# EAGLE design USBasp_smd03 (EAGLE 4.16)
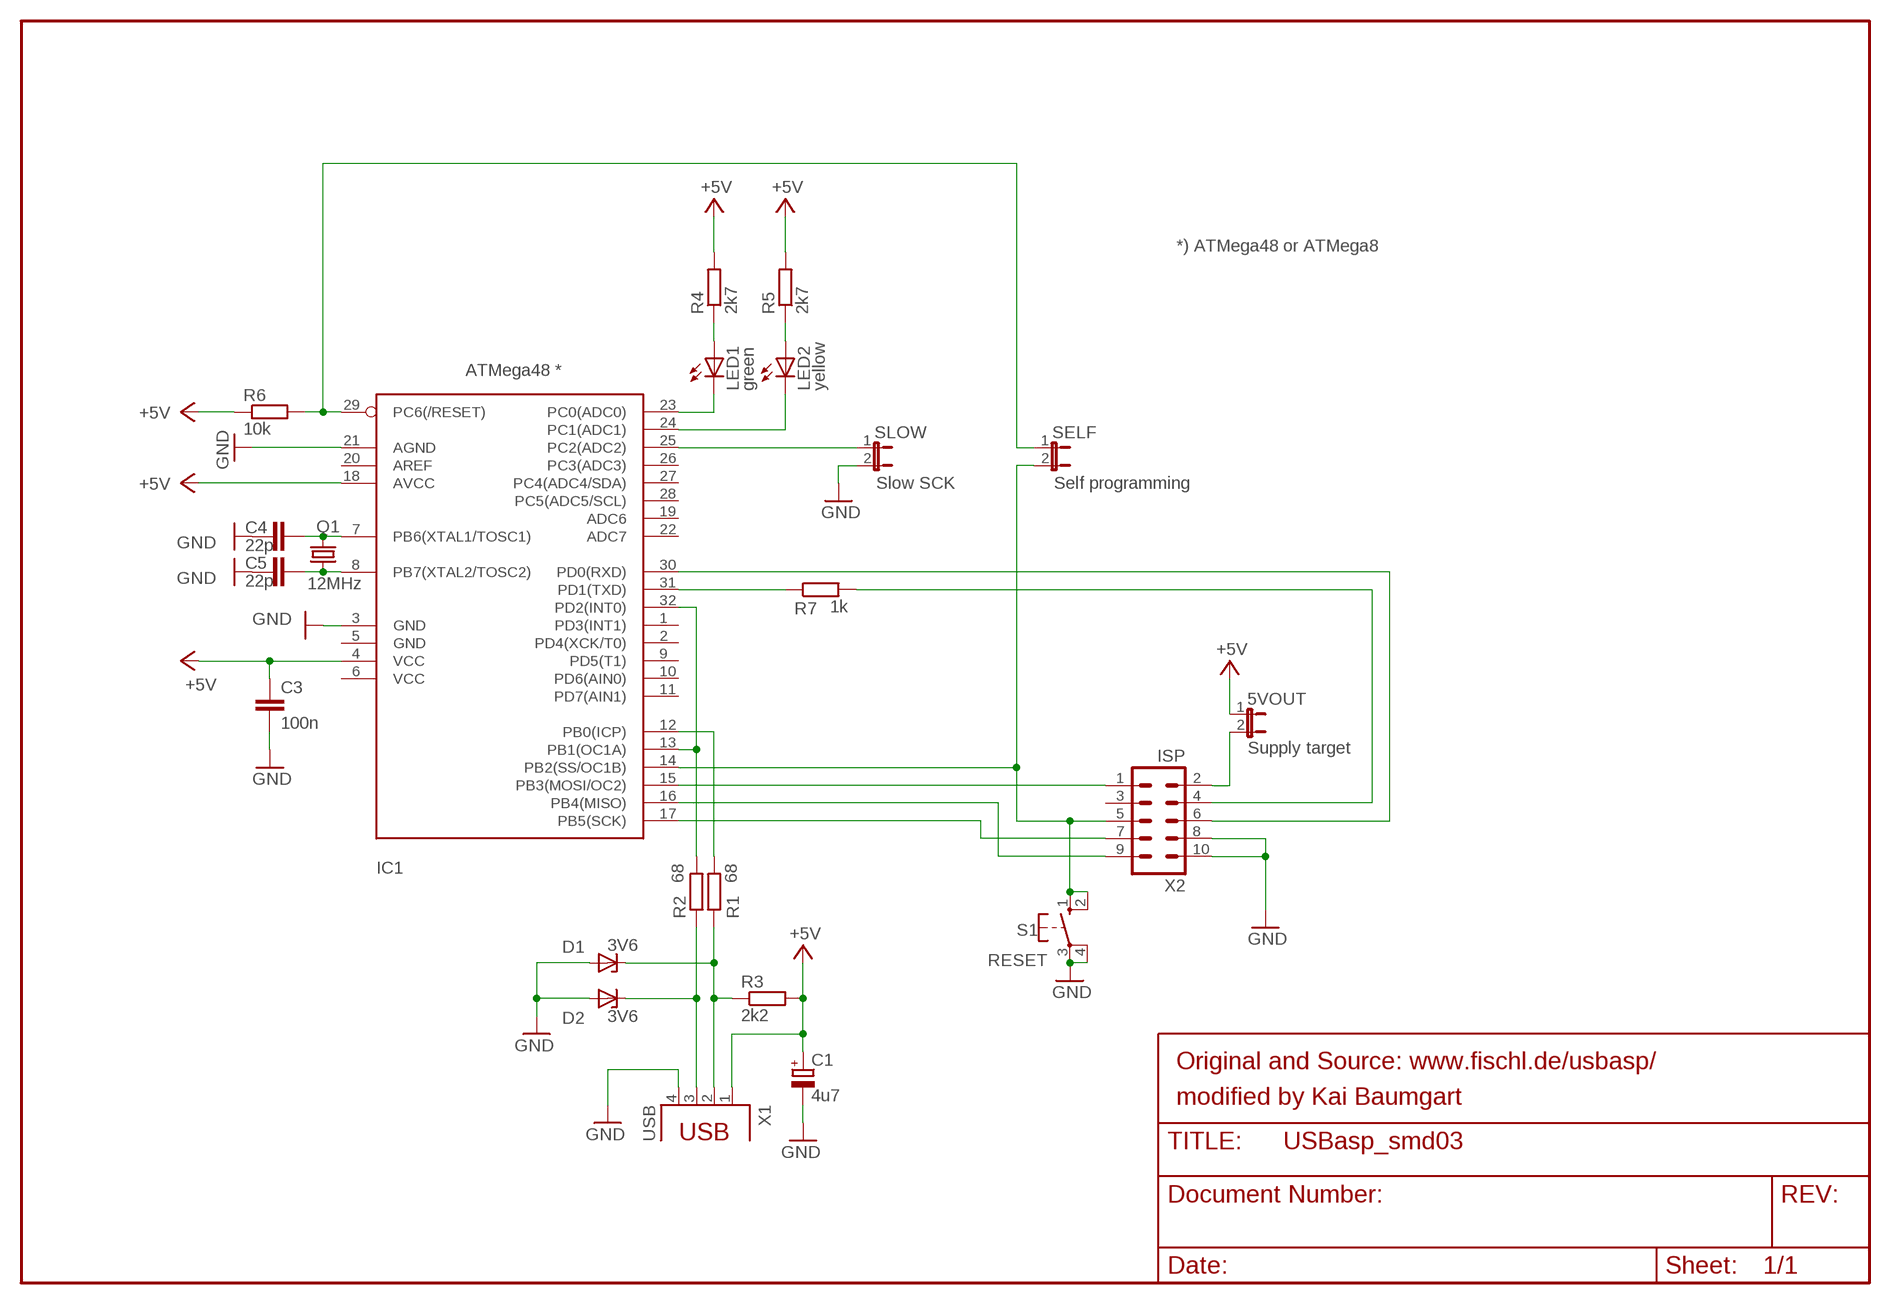
[diagram p0: schematic, sheet 1]

## Parts
5VOUT  Supply target  JP1E  [JP1]
C1  4u7  CPOL-EUE2.5-5  [E2,5-5]
C3  100n  C-EUC0603  [C0603]
C4  22p  C-EUC0603  [C0603]
C5  22p  C-EUC0603  [C0603]
D1  3V6  ZENER-DIODESOT23  [SOT23]
D2  3V6  ZENER-DIODESOT23  [SOT23]
IC1  ATMega48 *  MEGA8-AI  [TQFP32-08]
LED1  green  LEDCHIPLED_0603  [CHIPLED_0603]
LED2  yellow  LEDCHIPLED_0603  [CHIPLED_0603]
Q1  12MHz  CRYTALHC49S  [HC49/S]
R1  68  R-EU_R0805  [R0805]
R2  68  R-EU_R0805  [R0805]
R3  2k2  R-EU_R0805  [R0805]
R4  2k7  R-EU_R0805  [R0805]
R5  2k7  R-EU_R0805  [R0805]
R6  10k  R-EU_R0805  [R0805]
R7  1k  R-EU_R0805  [R0805]
S1  RESET  10-XX  [B3F-10XX]
SELF  Self programming  JP1E  [JP1]
SLOW  Slow SCK  JP1E  [JP1]
X1  USB  PN61729  [PN61729]
X2  ISP  ML10L  [ML10L]

## Nets
+5V: 5VOUT.1 C1.+ C3.1 IC1.4(VCC) IC1.18(AVCC) R3.2 R4.2 R5.2 R6.1 X1.1
GND: C1.- C3.2 C4.1 C5.2 D1.1(A) D2.1(A) IC1.3(GND) IC1.21(AGND) S1.3(P) S1.4(P1) SLOW.2 X1.4 X2.8 X2.10
N$1: IC1.29(PC6(/RESET)) R6.2 SELF.1
N$2: IC1.14(PB2(SS/OC1B)) S1.1(S) S1.2(S1) SELF.2 X2.5
N$3: IC1.15(PB3(MOSI/OC2)) X2.1
N$4: IC1.17(PB5(SCK)) X2.7
N$5: D1.3(C) R1.1 R3.1 X1.2
N$6: IC1.16(PB4(MISO)) X2.9
N$7: IC1.13(PB1(OC1A)) IC1.32(PD2(INT0)) R2.2
N$8: D2.3(C) R2.1 X1.3
N$9: IC1.31(PD1(TXD)) R7.1
N$10: R7.2 X2.4
N$11: IC1.30(PD0(RXD)) X2.6
N$12: IC1.25(PC2(ADC2)) SLOW.1
N$13: LED1.A R4.1
N$14: IC1.23(PC0(ADC0)) LED1.C
N$15: IC1.24(PC1(ADC1)) LED2.C
N$16: LED2.A R5.1
N$17: 5VOUT.2 X2.2
N$20: IC1.12(PB0(ICP)) R1.2
N$22: C4.2 IC1.7(PB6(XTAL1/TOSC1)) Q1.2
N$23: C5.1 IC1.8(PB7(XTAL2/TOSC2)) Q1.1
Unconnected: IC1.1(PD3(INT1)) IC1.2(PD4(XCK/T0)) IC1.5(GND) IC1.6(VCC) IC1.9(PD5(T1)) IC1.10(PD6(AIN0)) IC1.11(PD7(AIN1)) IC1.19(ADC6) IC1.20(AREF) IC1.22(ADC7) IC1.26(PC3(ADC3)) IC1.27(PC4(ADC4/SDA)) IC1.28(PC5(ADC5/SCL)) X2.3

## Notes on the sheet
- *) ATMega48 or ATMega8
- Original and Source: www.fischl.de/usbasp/
- modified by Kai Baumgart

## Library data of the parts
5VOUT SELF SLOW = jumper:JP1E: JUMPER
C1 = rcl:CPOL-EU: POLARIZED CAPACITOR, European symbol
C3-C5 = rcl:C-EU: CAPACITOR, European symbol
D1 D2 = diode:ZENER-DIODE: Z-Diode
IC1 = atmel:MEGA8: MICROCONTROLLER 8 Kbytes FLASH 1 kbytes SRAM 512 bytes EEPROM USART 6-channel 10 bit ADC 2-channel 8 bit ADC Source: avr.lbr
LED1 LED2 = led:LED: LED OSRAM: - CHIPLED LG R971, LG N971, LY N971, LG Q971, LY Q971, LO R971, LY R971 LH N974, LH R974 LS Q976, LO Q976, LY Q976 LO Q996 - Hyper CHIPLED LW Q18S LB Q993, LB Q99A, LB R99A - SideLED LS A670, LO A670, LY A670, LG A670, LP A670 LB A673, LV A673, LT A673, LW A673 LH A674 LY A675 LS A676, LA A676, LO A676, LY A676, LW A676 LS A679, LY A679, LG A679 - Hyper Micro SIDELED® LS Y876, LA Y876, LO Y876, LY Y876 LT Y87S - SmartLED LW L88C, LW L88S LB L89C, LB L89S, LG L890 LS L89K, LO L89K, LY L89K LS L896, LA L896, LO L896, LY L896 - TOPLED LS T670, LO T670, LY T670, LG T670, LP T670 LSG T670, LSP T670, LSY T670, LOP T670, LYG T670 LG T671, LOG T671, LSG T671 LB T673, LV T673, LT T673, LW T673 LH T674 LS T676, LA T676, LO T676, LY T676, LB T676, LH T676, LSB T676, LW T676 LB T67C, LV T67C, LT T67C, LS T67K, LO T67K, LY T67K, LW E67C LS E67B, LA E67B, LO E67B, LY E67B, LB E67C, LV E67C, LT E67C LW T67C LS T679, LY T679, LG T679 LS T770, LO T770, LY T770, LG T770, LP T770 LB T773, LV T773, LT T773, LW T773 LH T774 LS E675, LA E675, LY E675, LS T675 LS T776, LA T776, LO T776, LY T776, LB T776 LHGB T686 LT T68C, LB T68C - Hyper Mini TOPLED® LB M676 - Mini TOPLED Santana® LG M470 LS M47K, LO M47K, LY M47K Source: http://www.osram.convergy.de/
Q1 = crystal:CRYTAL: CRYSTAL
R1-R7 = rcl:R-EU_: RESISTOR, European symbol
S1 = switch-omron:10-XX: OMRON SWITCH
X1 = con-berg:PN61729: BERG USB connector
X2 = con-harting-ml:ML10: HARTING

## Board
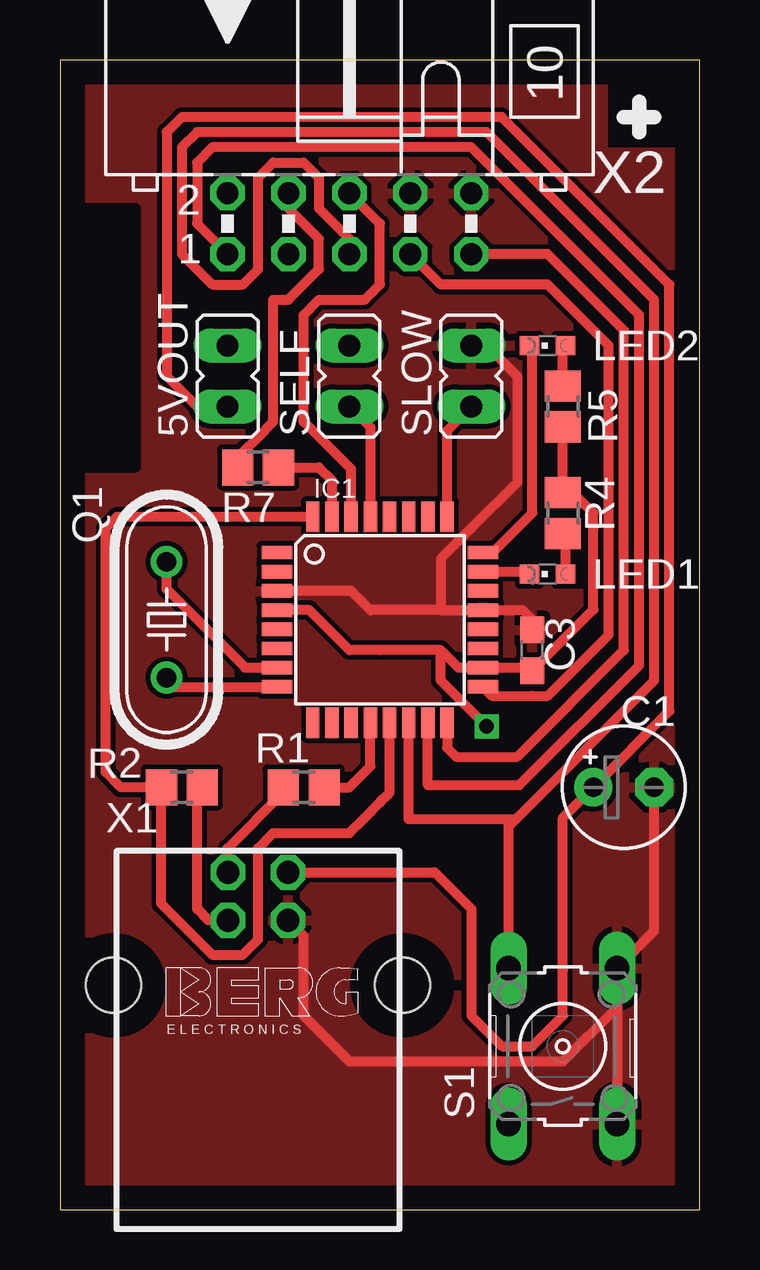
[diagram p1: board, top side]
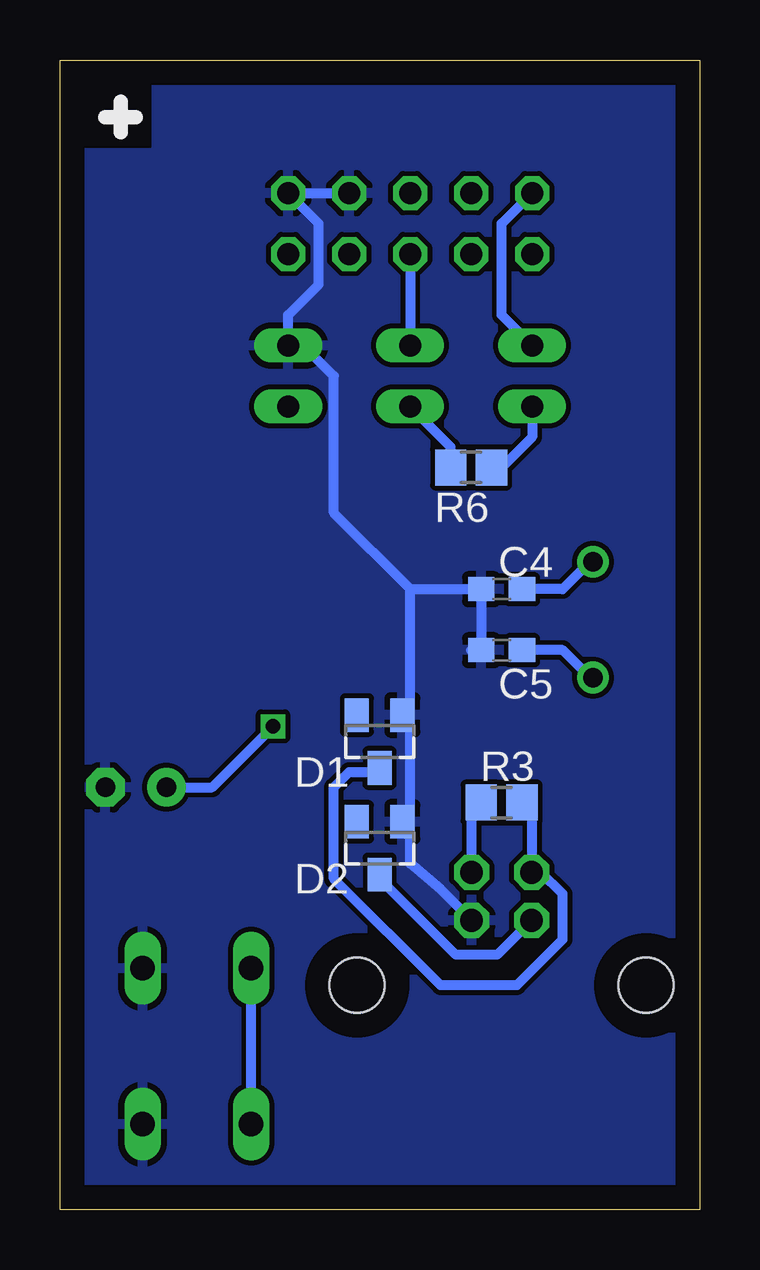
[diagram p2: board, bottom side, seen from below]

Size 26.65 x 47.93 mm. Coordinates in mm from the lower left corner, seen from the top.
Outline: 0,0 26.65,0 26.65,47.93 0,47.93 0,0
Copper layers (1*16): Top 0.035mm / dielectric 1.5mm / Bottom 0.035mm
Design rules "olimex_8mils": minimum track width 10mil, minimum drill 24mil, track to track 8mil, track to pad 8mil, pad to pad 8mil, via to via 8mil, smd to smd 8mil, copper to edge 40mil, drill to drill 10mil, minimum pad ring 10mil, minimum via ring 8mil, stop-mask expansion 0mil, vias tented up to drill 0mil, thermal gap 10mil
tRestrict: 8 lines
bRestrict: 4 lines

### Footprints (pad centres in the part's own frame; a part is rotated, then mirrored left to right if it is on the bottom)
JP1 = drill 0.914 long: 1 0,-1.27; 2 0,1.27
E2,5-5 = drill 0.813 pad 1.6 round: + -1.27,0 | drill 0.813 pad 1.6 octagon: - 1.27,0
C0603 = smd 1.1 x 1: 1 -0.85,0; 2 0.85,0
SOT23 = smd 1 x 1.4: 1 -0.95,-1.1; 2 0.95,-1.1; 3 0,1.1
TQFP32-08 = smd 1.27 x 0.559: 1 -4.293,2.8; 2 -4.293,2; 3 -4.293,1.2; 4 -4.293,0.4; 5 -4.293,-0.4; 6 -4.293,-1.2; 7 -4.293,-2; 8 -4.293,-2.8; 17 4.293,-2.8; 18 4.293,-2; 19 4.293,-1.2; 20 4.293,-0.4; 21 4.293,0.4; 22 4.293,1.2; 23 4.293,2; 24 4.293,2.8 | smd 0.559 x 1.27: 9 -2.8,-4.293; 10 -2,-4.293; 11 -1.2,-4.293; 12 -0.4,-4.293; 13 0.4,-4.293; 14 1.2,-4.293; 15 2,-4.293; 16 2.8,-4.293; 25 2.8,4.293; 26 2,4.293; 27 1.2,4.293; 28 0.4,4.293; 29 -0.4,4.293; 30 -1.2,4.293; 31 -2,4.293; 32 -2.8,4.293
CHIPLED_0603 = smd 0.8 x 0.8: A 0,-0.75; C 0,0.75
HC49/S = drill 0.813 round: 1 -2.413,0; 2 2.413,0
R0805 = smd 1.3 x 1.5: 1 -0.85,0; 2 0.85,0
B3F-10XX = drill 1.016 long: 1 -3.251,2.261; 2 3.251,2.261; 3 -3.251,-2.261; 4 3.251,-2.261
PN61729 = drill 0.95 octagon: 1 1.25,4.71; 2 -1.25,4.71; 3 -1.25,2.71; 4 1.25,2.71 | hole 2.3: -6.02,0; 6.02,0
ML10L = drill 0.914 octagon: 1 -5.08,-1.27; 2 -5.08,1.27; 3 -2.54,-1.27; 4 -2.54,1.27; 5 0,-1.27; 6 0,1.27; 7 2.54,-1.27; 8 2.54,1.27; 9 5.08,-1.27; 10 5.08,1.27

### Placement (x,y rotation side)
5VOUT  6.98,34.76 0 top
C1  23.49,17.61 0 top
C3  19.68,23.33 90 top
C4  8.25,25.87 0 bottom
C5  8.25,23.33 180 bottom
D1  13.33,19.52 180 bottom
D2  13.33,15.08 180 bottom
IC1  13.33,24.6 0 top
LED1  20.31,26.5 90 top
LED2  20.31,36.03 90 top
Q1  4.44,24.6 90 top
R1  10.16,17.61 0 top
R2  5.08,17.61 180 top
R3  8.25,16.98 180 bottom
R4  20.95,29.04 90 top
R5  20.95,33.49 270 top
R6  9.52,30.95 180 bottom
R7  8.25,30.95 180 top
S1  20.95,6.82 90 top
SELF  12.06,34.76 0 top
SLOW  17.14,34.76 0 top
X1  8.25,9.36 0 top
X2  12.06,41.11 0 top

### Tracks (layer width: path | path; a pad name or v marks a point on that pad's centre or on a via)
+5V  (via drill 0.6)
  Top 0.406: IC1.4 10.39,25 12.06,23.33 13.33,23.33 15.87,23.33 | 15.87,23.33 16.5,22.7 16.6,22.6 IC1.18 19.58,22.6 19.68,22.7 C3.1 22.22,25.02 22.22,28.41 22.22,29.04 21.58,29.68 20.95,29.68 | 20.95,29.68 R4.2 | 20.95,29.68 R4.2 | R4.2 R5.2 | 20.95,29.68 R4.2 | 5VOUT.1 5.71,33.49 4.44,34.76 4.44,44.92 5.08,45.55 18.41,45.55 25.39,38.57 25.39,20.79 C1.+ 20.95,16.34 20.95,10 20.95,8.09 19.68,6.82 18.41,6.82 17.14,8.09 17.14,12.54 15.61,14.07 X1.1 | v17.77,20.15 15.87,22.06 15.87,23.33
  Bottom 0.406: 5VOUT.1 6.98,32.22 8.25,30.95 8.89,30.95 R6.1 | R3.2 9.52,16.98 9.5,16.96 X1.1 | C1.+ 20.31,17.61 v17.77,20.15
GND
  Top 0.406: 15.87,25 12.93,25 12.7,25.23 12.13,25.8 IC1.3 | 15.87,25 IC1.21 19.28,25 19.68,24.6 19.68,23.96 C3.2 | 15.87,25 15.87,27.14 17.14,28.41 19.04,30.31 19.04,34.76 17.77,36.03 SLOW.2 | X1.4 10.16,11.42 10.16,8.09 12.06,6.18 12.7,6.18 20.59,6.18 20.95,6.18 23.21,8.45 S1.4 | S1.4 24.76,11.62 C1.- | S1.4 23.41,10.07 23.49,10 23.21,9.72 S1.3
  Bottom 0.406: C5.2 9.52,23.33 9.1,23.75 C4.1 12.06,25.87 | 12.06,20.79 12.06,22.06 12.06,25.87 | 12.06,20.79 12.06,19.52 12.06,16.34 | 12.06,16.34 12.06,14.44 10.79,13.36 X1.4 | X2.8 X2.10 15.87,41.11 15.87,38.57 17.14,37.3 SLOW.2 16.5,36.03 15.24,34.76 15.24,29.04 12.06,25.87 | D1.1 12.53,20.62 12.7,20.79 12.06,20.79 | D2.1 12.23,16.18 12.06,16.34
  pour Top: -0.01,48.09 26.66,48.09 26.66,-0.17 -0.01,-0.17
  pour Bottom: -0.01,48.09 26.66,48.09 26.66,-0.17 -0.01,-0.17
N$1
  Top 0.406: IC1.29 12.93,32.62 SELF.1
  Bottom 0.406: SELF.1 10.37,31.8 R6.2 10.79,30.95
N$2
  Top 0.406: IC1.14 14.53,16.27 14.6,16.27 | 14.6,16.27 18.97,16.27 19.04,16.34 | 19.04,16.34 24.76,22.06 24.76,37.94 17.77,44.92 5.71,44.92 5.08,44.28 5.08,39.84 6.34,38.57 7.62,38.57 8.25,39.2 8.25,43.02 8.89,43.65 10.16,43.65 10.79,43.02 10.79,41.74 12.06,40.48 X2.5 | 14.6,16.27 14.6,16.34 | S1.2 18.69,15.99 19.04,16.34
  Bottom 0.406: X2.5 SELF.2 | S1.1 18.49,3.57 18.41,3.64 18.69,3.92 S1.2
N$3
  Top 0.406: IC1.15 15.33,17.71 19.14,17.71 24.12,22.7 24.12,37.3 17.14,44.28 6.34,44.28 5.71,43.65 5.71,41.11 X2.1
N$4
  Top 0.406: X2.7 15.87,38.57 20.31,38.57 22.86,36.03 22.86,23.96 20.31,21.42 19.68,21.42 18,21.42 IC1.17
N$5
  Top 0.406: R1.1 9.31,17.4 6.98,15.08 6.98,14.44 7,14.42 X1.2
  Bottom 0.406: R3.1 6.98,16.56 6.98,14.44 6.98,14.09 X1.2 6.61,14.07 5.71,13.17 5.71,11.27 7.62,9.36 10.79,9.36 15.24,13.81 15.24,17.61 14.6,18.25 13.33,18.25 D1.3
N$6
  Top 0.406: IC1.16 16.13,19.26 16.5,18.88 19.04,18.88 23.49,23.33 23.49,36.66 20.31,39.84 X2.9
N$7
  Top 0.406: IC1.32 2.38,28.89 1.9,28.41 1.9,19.52 1.9,18.25 2.54,17.61 4.44,17.61 | IC1.13 13.73,17.38 13.33,16.98 12.7,16.34 12.06,15.71 8.89,15.71 8.25,15.08 8.25,11.27 7.62,10.63 6.34,10.63 4.23,12.75 4.23,17.4 4.44,17.61 | 4.44,17.61 R2.2 4.44,17.61
N$8
  Top 0.406: X1.3 6.17,12.07 5.71,12.54 5.71,17.61 R2.1
  Bottom 0.406: X1.3 8.44,10.63 9.52,10.63 10.16,10.63 13.33,13.81 D2.3
N$9
  Top 0.406: IC1.31 11.33,30.41 10.79,30.95 R7.1
N$10
  Top 0.406: R7.2 7.62,30.95 7.62,31.58 8.25,32.22 8.89,32.85 8.89,37.94 9.52,37.94 10.79,39.2 10.79,40.48 10.16,41.11 9.52,41.74 X2.4
N$11
  Top 0.406: IC1.30 12.13,30.88 10.16,32.85 10.16,37.3 10.79,37.94 12.7,37.94 13.33,38.57 13.33,41.11 X2.6
N$12
  Top 0.406: IC1.25 16.13,32.48 SLOW.1
N$13
  Top 0.406: R4.1 20.95,27.77 21.06,27.66 LED1.A
N$14
  Top 0.406: LED1.C 19.68,26.5 19.58,26.6 IC1.23
N$15
  Top 0.406: IC1.24 18.04,27.4 19.68,29.04 19.68,36.03 LED2.C
N$16
  Top 0.406: LED2.A 20.95,36.03 R5.1
N$17
  Bottom 0.406: 5VOUT.2 8.25,37.3 8.25,41.11 X2.2
N$18
  Top 0.61: 24.12,44.92 24.12,46.19
N$19
  Top 0.61: 23.49,45.55 24.76,45.55
N$20
  Top 0.406: IC1.12 12.93,18.48 12.06,17.61 10.79,17.61 R1.2
N$21
  Bottom 0.61: 24.12,44.92 24.12,46.19
N$22
  Top 0.406: IC1.7 7.71,22.6 4.44,25.87 Q1.2 4.44,27.14
  Bottom 0.406: Q1.2 4.44,27.14 5.71,25.87 C4.2
N$23
  Top 0.406: Q1.1 4.44,22.06 4.7,21.8 IC1.8
  Bottom 0.406: Q1.1 4.44,22.06 5.71,23.33 C5.1
N$24
  Bottom 0.61: 23.49,45.55 24.76,45.55

### Text on the board
tRestrict: usbasp_v0.3